# Altium schematic sheet Sheet1.SchDoc
size A2; SheetNumber: 1; SheetTotal: 1
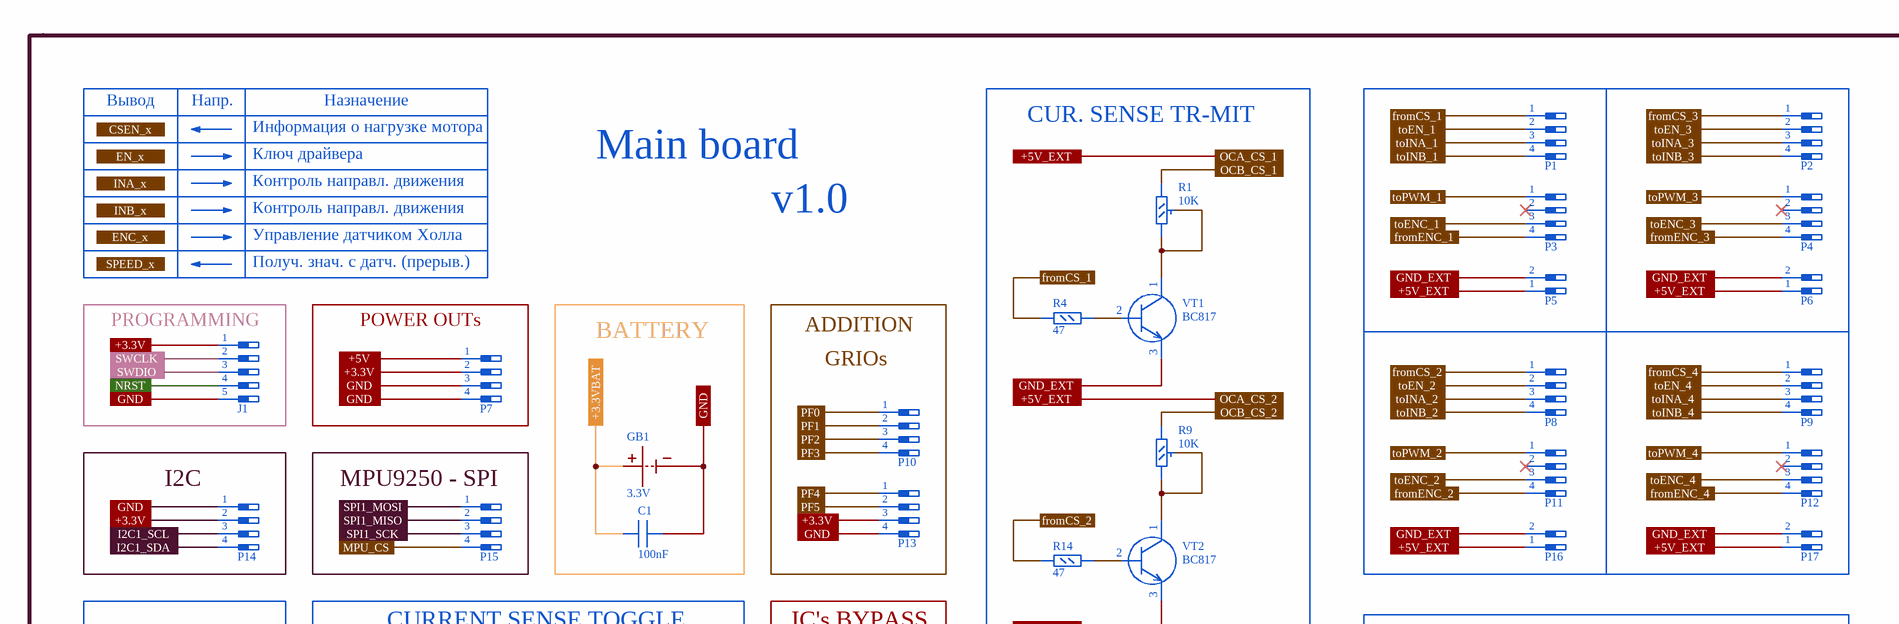
[diagram p0: Sheet1.SchDoc, top left]
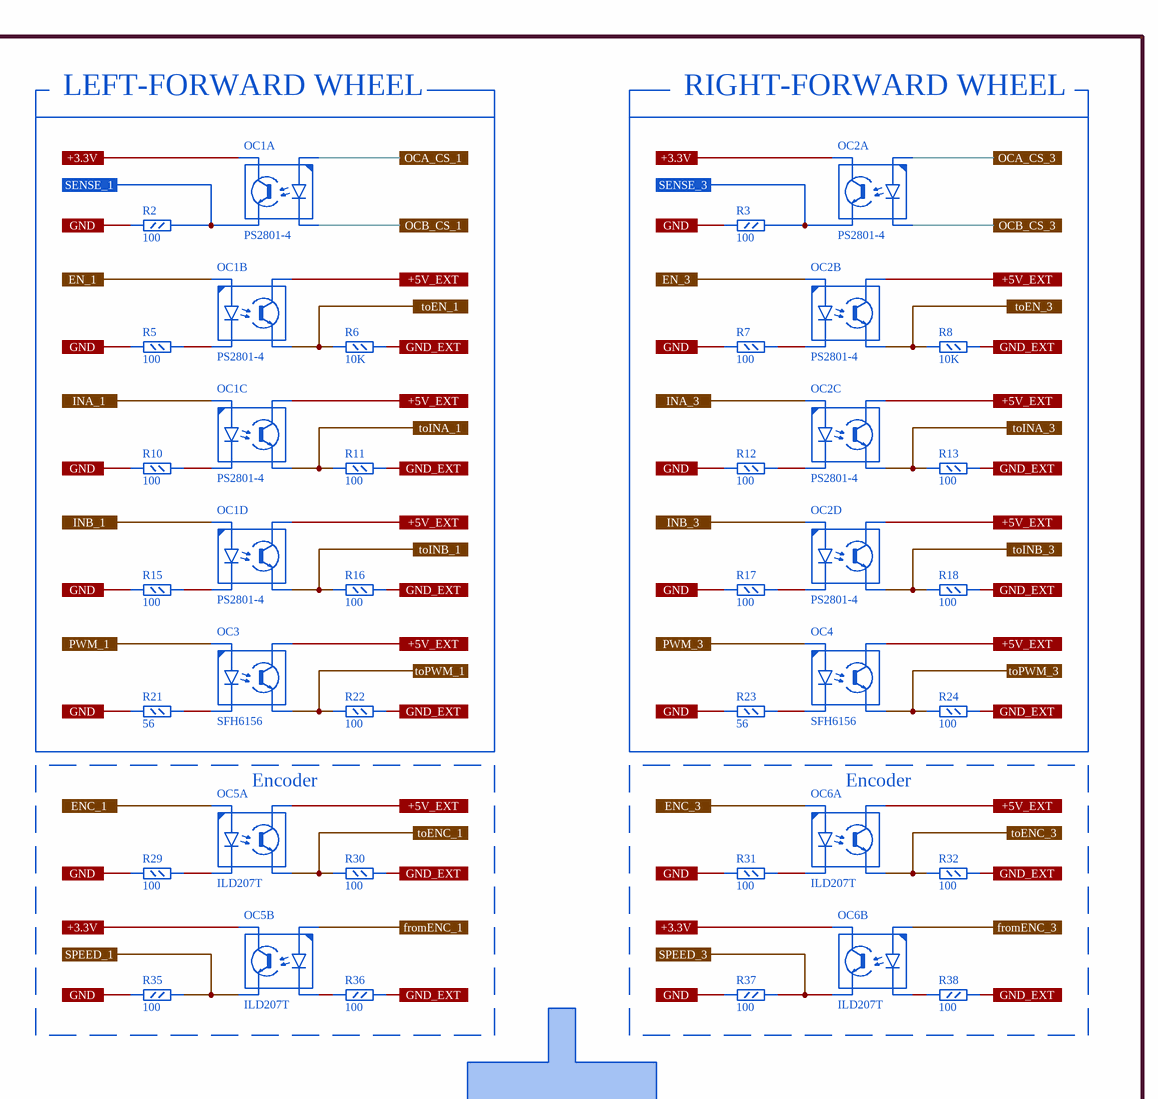
[diagram p1: Sheet1.SchDoc, top right]
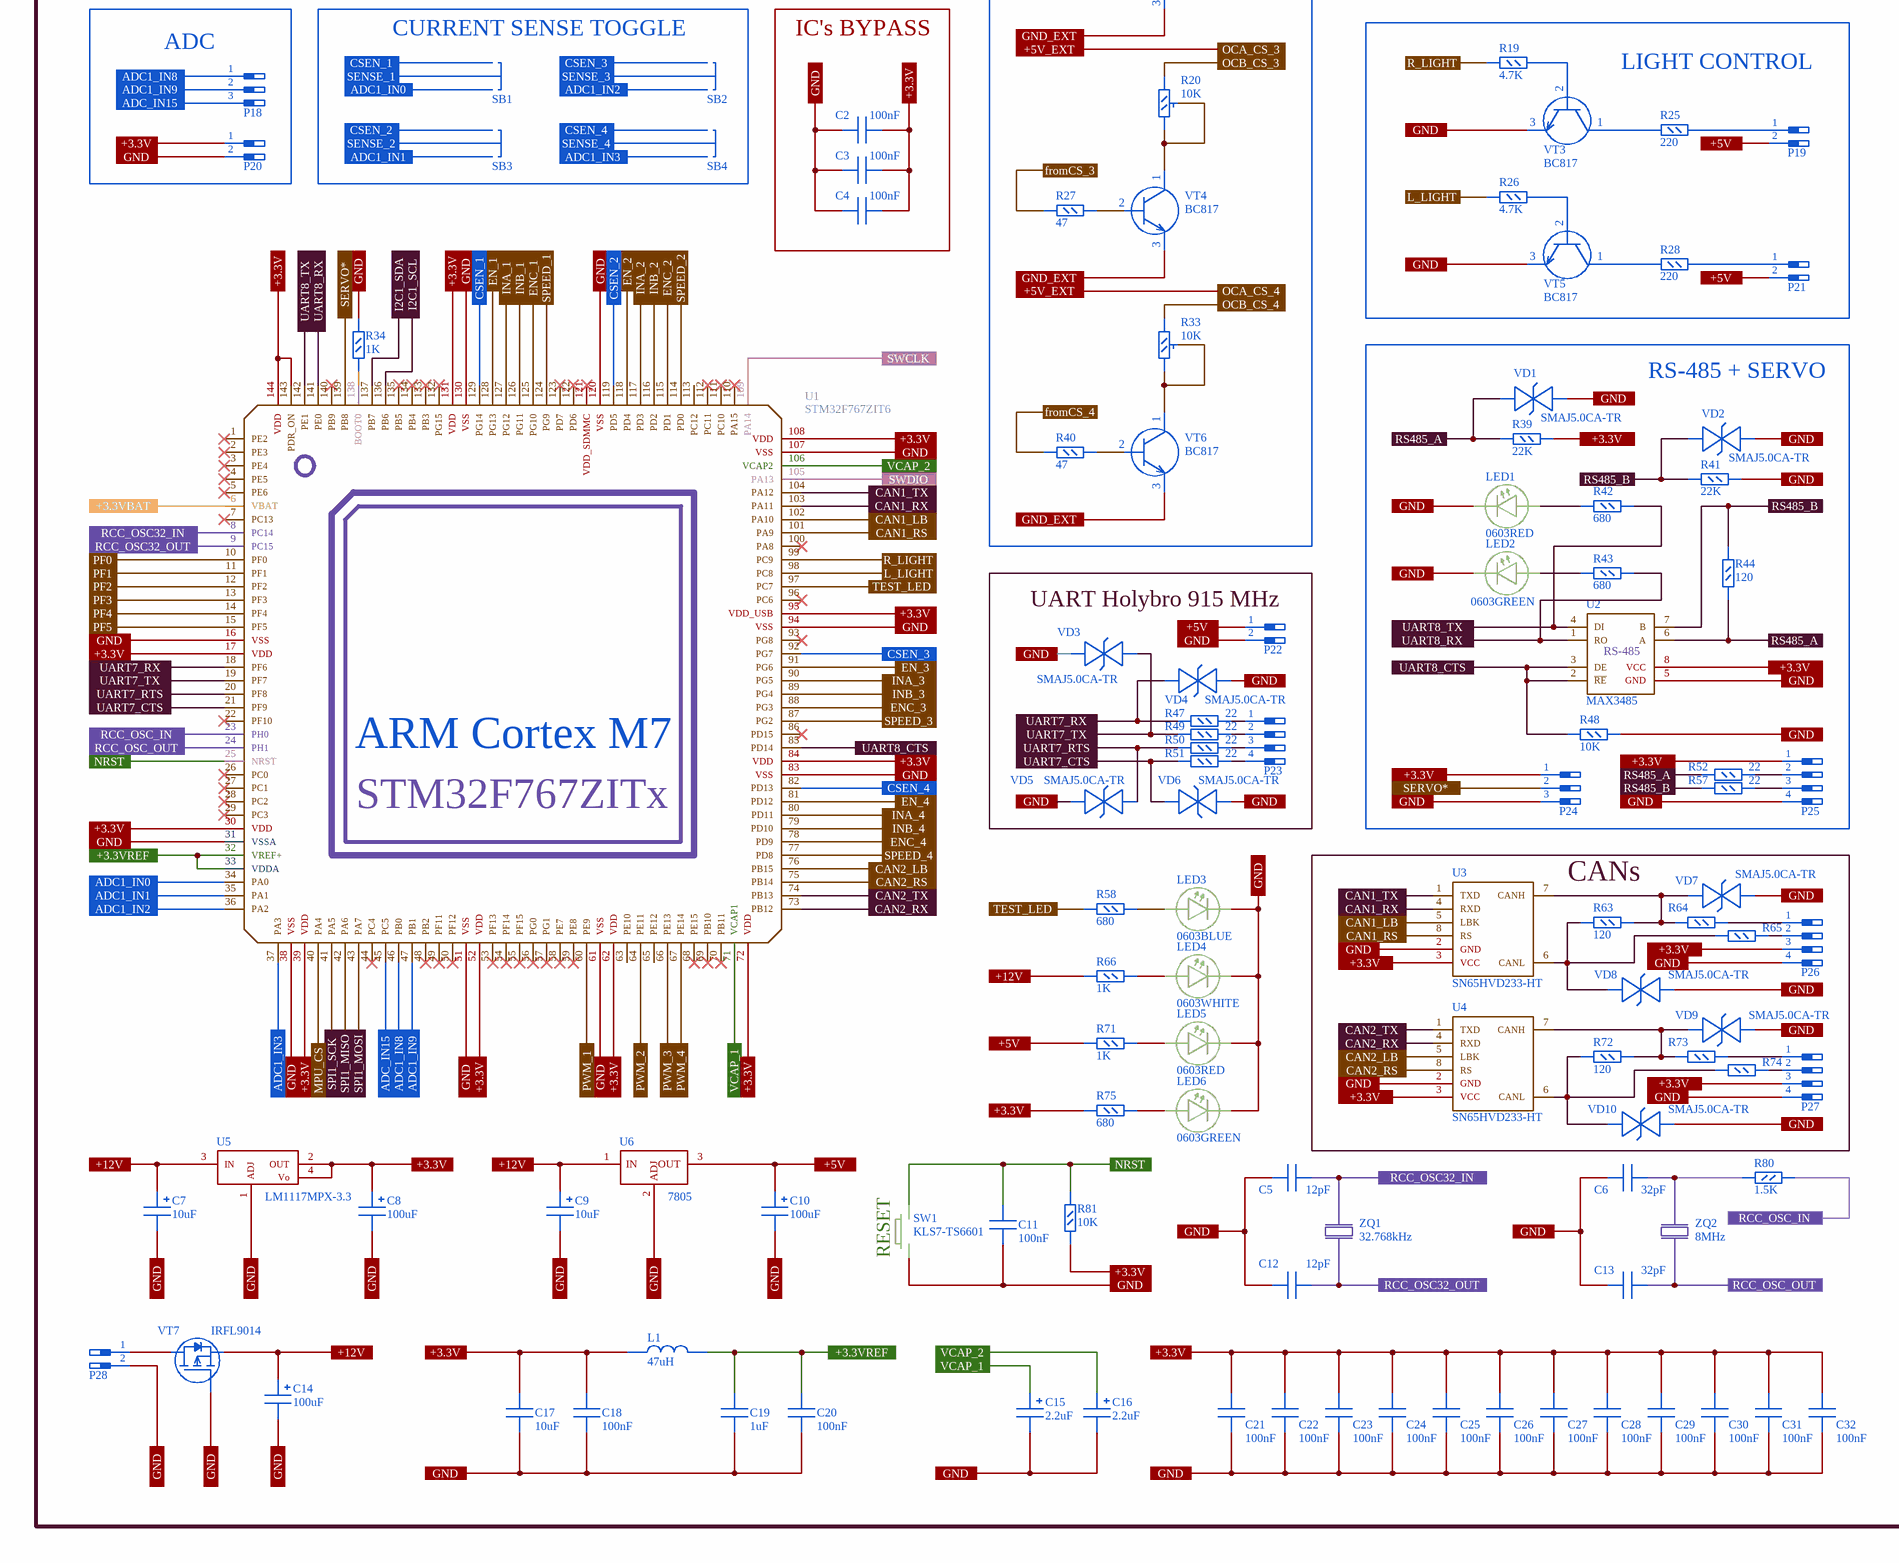
[diagram p2: Sheet1.SchDoc, bottom left]
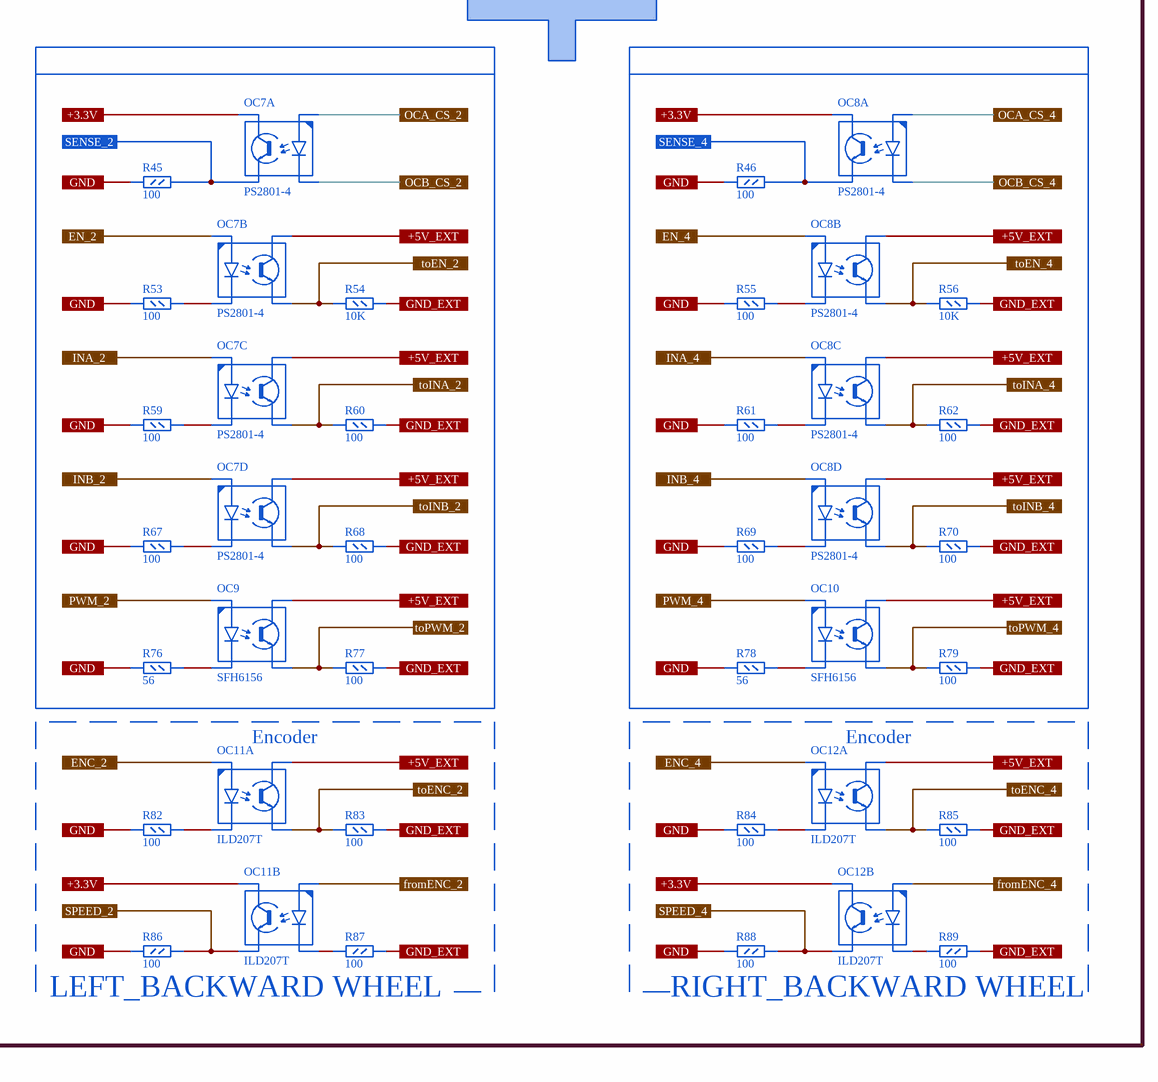
[diagram p3: Sheet1.SchDoc, bottom right]

## Parts
C1  100nF  [C0603]
C2  100nF  [C0603]
C3  100nF  [C0603]
C4  100nF  [C0603]
C5  12pF  [C0603]
C6  32pF  [C0603]
C7  10uF  [CAP-ALSMD-4x5.4]
C8  100uF  [CAP-ALSMD-6.3x5.4]
C9  10uF  [CAP-ALSMD-4x5.4]
C10  100uF  [CAP-ALSMD-6.3x5.4]
C11  100nF  [C0603]
C12  12pF  [C0603]
C13  32pF  [C0603]
C14  100uF  [CAP-ALSMD-6.3x5.4]
C15  2.2uF  [CAP-ALSMD-4x5.4]
C16  2.2uF  [CAP-ALSMD-4x5.4]
C17  10uF  [C0805]
C18  100nF  [C0603]
C19  1uF  [C0805]
C20  100nF  [C0603]
C21  100nF  [C0603]
C22  100nF  [C0603]
C23  100nF  [C0603]
C24  100nF  [C0603]
C25  100nF  [C0603]
C26  100nF  [C0603]
C27  100nF  [C0603]
C28  100nF  [C0603]
C29  100nF  [C0603]
C30  100nF  [C0603]
C31  100nF  [C0603]
C32  100nF  [C0603]
GB1  3.3V  [CR1616-SMD]
J1  1x05  [5X1F]  (value not drawn)
L1  47uH  [L0805]
LED1  0603RED  [LED0603]
LED2  0603GREEN  [LED0603]
LED3  0603BLUE  [LED0603]
LED4  0603WHITE  [LED0603]
LED5  0603RED  [LED0603]
LED6  0603GREEN  [LED0603]
OC1  PS2801-4  [SOP16]  (parts A,B,C,D of 4)
OC2  PS2801-4  [SOP16]  (parts A,B,C,D of 4)
OC3  SFH6156  [SMD-4 (WIDE PINS)]
OC4  SFH6156  [SMD-4 (WIDE PINS)]
OC5  ILD207T  [SOIC8]  (parts A,B of 2)
OC6  ILD207T  [SOIC8]  (parts A,B of 2)
OC7  PS2801-4  [SOP16]  (parts A,B,C,D of 4)
OC8  PS2801-4  [SOP16]  (parts A,B,C,D of 4)
OC9  SFH6156  [SMD-4 (WIDE PINS)]
OC10  SFH6156  [SMD-4 (WIDE PINS)]
OC11  ILD207T  [SOIC8]  (parts A,B of 2)
OC12  ILD207T  [SOIC8]  (parts A,B of 2)
P1  1x04  [CWF-4R-2.50]  (value not drawn)
P2  1x04  [CWF-4R-2.50]  (value not drawn)
P3  1x04  [CWF-4R-2.50]  (value not drawn)
P4  1x04  [CWF-4R-2.50]  (value not drawn)
P5  1x02  [H2-5.08]  (value not drawn)
P6  1x02  [H2-5.08]  (value not drawn)
P7  1x04  [XH2.54-4PIN]  (value not drawn)
P8  1x04  [CWF-4R-2.50]  (value not drawn)
P9  1x04  [CWF-4R-2.50]  (value not drawn)
P10  1x04  [XH2.54-4PIN]  (value not drawn)
P11  1x04  [CWF-4R-2.50]  (value not drawn)
P12  1x04  [CWF-4R-2.50]  (value not drawn)
P13  1x04  [XH2.54-4PIN]  (value not drawn)
P14  1x04  [XH2.54-4PIN]  (value not drawn)
P15  1x04  [XH2.54-4PIN]  (value not drawn)
P16  1x02  [H2-5.08]  (value not drawn)
P17  1x02  [H2-5.08]  (value not drawn)
P18  1x03  [XH2.54-3PIN]  (value not drawn)
P19  1x02  [XH2.54-2PIN]  (value not drawn)
P20  1x02  [XH2.54-2PIN]  (value not drawn)
P21  1x02  [XH2.54-2PIN]  (value not drawn)
P22  1x02  [XH2.54-2PIN]  (value not drawn)
P23  1x04  [XH2.54-4PIN]  (value not drawn)
P24  1x03  [XH2.54-3PIN]  (value not drawn)
P25  1x04  [XH2.54-4PIN]  (value not drawn)
P26  1x04  [XH2.54-4PIN]  (value not drawn)
P27  1x04  [XH2.54-4PIN]  (value not drawn)
P28  1x02  [H2-5.08]  (value not drawn)
R1  10K  [EVM3]
R2  100  [R0603]
R3  100  [R0603]
R4  47  [R0805]
R5  100  [R0603]
R6  10K  [R0603]
R7  100  [R0603]
R8  10K  [R0603]
R9  10K  [EVM3]
R10  100  [R0603]
R11  100  [R0603]
R12  100  [R0603]
R13  100  [R0603]
R14  47  [R0805]
R15  100  [R0603]
R16  100  [R0603]
R17  100  [R0603]
R18  100  [R0603]
R19  4.7K  [R0603]
R20  10K  [EVM3]
R21  56  [R0805]
R22  100  [R0603]
R23  56  [R0805]
R24  100  [R0603]
R25  220  [R0603]
R26  4.7K  [R0603]
R27  47  [R0805]
R28  220  [R0603]
R29  100  [R0603]
R30  100  [R0603]
R31  100  [R0603]
R32  100  [R0603]
R33  10K  [EVM3]
R34  1K  [R0603]
R35  100  [R0603]
R36  100  [R0603]
R37  100  [R0603]
R38  100  [R0603]
R39  22K  [R0603]
R40  47  [R0805]
R41  22K  [R0603]
R42  680  [R0603]
R43  680  [R0603]
R44  120  [R0603]
R45  100  [R0603]
R46  100  [R0603]
R47  22  [R0805]
R48  10K  [R0603]
R49  22  [R0805]
R50  22  [R0805]
R51  22  [R0805]
R52  22  [R0805]
R53  100  [R0603]
R54  10K  [R0603]
R55  100  [R0603]
R56  10K  [R0603]
R57  22  [R0805]
R58  680  [R0603]
R59  100  [R0603]
R60  100  [R0603]
R61  100  [R0603]
R62  100  [R0603]
R63  120  [R0603]
R64  22  [R0805]  (value not drawn)
R65  22  [R0805]  (value not drawn)
R66  1K  [R0603]
R67  100  [R0603]
R68  100  [R0603]
R69  100  [R0603]
R70  100  [R0603]
R71  1K  [R0603]
R72  120  [R0603]
R73  22  [R0805]  (value not drawn)
R74  22  [R0805]  (value not drawn)
R75  680  [R0603]
R76  56  [R0805]
R77  100  [R0603]
R78  56  [R0805]
R79  100  [R0603]
R80  1.5K  [R0603]
R81  10K  [R0603]
R82  100  [R0603]
R83  100  [R0603]
R84  100  [R0603]
R85  100  [R0603]
R86  100  [R0603]
R87  100  [R0603]
R88  100  [R0603]
R89  100  [R0603]
SB1  Soldier Toggle  [SOLDBR-3]  (value not drawn)
SB2  Soldier Toggle  [SOLDBR-3]  (value not drawn)
SB3  Soldier Toggle  [SOLDBR-3]  (value not drawn)
SB4  Soldier Toggle  [SOLDBR-3]  (value not drawn)
SW1  KLS7-TS6601  [BUT6.5X4.5]
U1  STM32F767ZIT6  [LQFP144]
U2  MAX3485  [SOIC8]
U3  SN65HVD233-HT  [SOIC8]
U4  SN65HVD233-HT  [SOIC8]
U5  LM1117MPX-3.3  [SOT-223]
U6  7805  [D2PAK]
VD1  SMAJ5.0CA-TR  [SMA]
VD2  SMAJ5.0CA-TR  [SMA]
VD3  SMAJ5.0CA-TR  [SMA]
VD4  SMAJ5.0CA-TR  [SMA]
VD5  SMAJ5.0CA-TR  [SMA]
VD6  SMAJ5.0CA-TR  [SMA]
VD7  SMAJ5.0CA-TR  [SMA]
VD8  SMAJ5.0CA-TR  [SMA]
VD9  SMAJ5.0CA-TR  [SMA]
VD10  SMAJ5.0CA-TR  [SMA]
VT1  BC817  [SOT-23-1P]
VT2  BC817  [SOT-23-1P]
VT3  BC817  [SOT-23-1P]
VT4  BC817  [SOT-23-1P]
VT5  BC817  [SOT-23-1P]
VT6  BC817  [SOT-23-1P]
VT7  IRFL9014  [SOT-223-24]
ZQ1  32.768kHz  [NX3215SA]
ZQ2  8MHz  [CRYSTALL-SMD]

## Blocks framed on the sheet
CUR. SENSE TR-MIT: R1 R4 R9 R14 R20 R27 R33 R40 VT1 VT2 VT4 VT6
PROGRAMMING: J1
POWER OUTs: P7
BATTERY: C1 GB1
I2C: P14
MPU9250 - SPI: P15
ADC: P18 P20
CURRENT SENSE TOGGLE: SB1-SB4
IC's BYPASS: C2-C4
LIGHT CONTROL: P19 P21 R19 R25 R26 R28 VT3 VT5
RS-485 + SERVO: LED1 LED2 P24 P25 R39 R41-R44 R48 R52 R57 U2 VD1 VD2
UART Holybro 915 MHz: P22 P23 R47 R49-R51 VD3-VD6
CANs: P26 P27 R63-R65 R72-R74 U3 U4 VD7-VD10

## Ports
+3.3V, +3.3VBAT, +3.3VREF, +5V, +5V_EXT, +12V, ADC1_IN0, ADC1_IN1, ADC1_IN2, ADC1_IN3, ADC1_IN8, ADC1_IN9, ADC_IN15, CAN1_LB, CAN1_RS, CAN1_RX, CAN1_TX, CAN2_LB, CAN2_RS, CAN2_RX, CAN2_TX, CSEN_1, CSEN_2, CSEN_3, CSEN_4, CSEN_x, EN_1, EN_2, EN_3, EN_4, EN_x, ENC_1, ENC_2, ENC_3, ENC_4, ENC_x, fromCS_1, fromCS_2, fromCS_3, fromCS_4, fromENC_1, fromENC_2, fromENC_3, fromENC_4, GND, GND_EXT, I2C1_SCL, I2C1_SDA, INA_1, INA_2, INA_3, INA_4, INA_x, INB_1, INB_2, INB_3, INB_4, INB_x, L_LIGHT, MPU_CS, NRST, OCA_CS_1, OCA_CS_2, OCA_CS_3, OCA_CS_4, OCB_CS_1, OCB_CS_2, OCB_CS_3, OCB_CS_4, PF0, PF1, PF2, PF3, PF4, PF5, PWM_1, PWM_2, PWM_3, PWM_4, R_LIGHT, RCC_OSC32_IN, RCC_OSC32_OUT, RCC_OSC_IN, RCC_OSC_OUT, RS485_A, RS485_B, SENSE_1, SENSE_2, SENSE_3, SENSE_4, SERVO*, SPEED_1, SPEED_2, SPEED_3, SPEED_4, SPEED_x, SPI1_MISO, SPI1_MOSI, SPI1_SCK, SWCLK, SWDIO, TEST_LED, toEN_1, toEN_2, toEN_3, toEN_4, toENC_1, toENC_2, toENC_3, toENC_4, toINA_1, toINA_2, toINA_3, toINA_4, toINB_1, toINB_2, toINB_3, toINB_4, toPWM_1, toPWM_2, toPWM_3, toPWM_4, UART7_CTS, UART7_RTS, UART7_RX, UART7_TX, UART8_CTS, UART8_RX, UART8_TX, VCAP_1, VCAP_2

## Nets
+3.3V: C2.2 C3.2 C4.2 C8.1 C17.2 C18.2 C21.2 C22.2 C23.2 C24.2 C25.2 C26.2 C27.2 C28.2 C29.2 C30.2 C31.2 C32.2 J1.1 L1.1 OC1.16 OC2.16 OC5.6 OC6.6 OC7.16 OC8.16 OC11.6 OC12.6 P7.2 P13.3 P14.2 P20.1 P24.1 P25.1 P26.3 P27.3 R39.1 R75.2 R81.2 U1.17(VDD) U1.30(VDD) U1.39(VDD) U1.52(VDD) U1.62(VDD) U1.72(VDD) U1.84(VDD) U1.95(VDD_USB) U1.108(VDD) U1.131(VDD) U1.143(PDR_ON) U1.144(VDD) U2.8(VCC) U3.3(VCC) U4.3(VCC) U5.2(OUT) U5.4(Vo) ; port +3.3V
+3.3VBAT: C1.1 GB1.2 U1.6(VBAT) ; port +3.3VBAT
+3.3VREF: C19.2 C20.2 L1.2 U1.32(VREF+) U1.33(VDDA) ; port +3.3VREF
+5V: C10.1 P7.1 P19.2 P21.2 P22.1 R71.2 U6.3(OUT) ; port +5V
+5V_EXT: OC1.1 OC1.10 OC1.12 OC1.14 OC2.1 OC2.10 OC2.12 OC2.14 OC3.4 OC4.4 OC5.8 OC6.8 OC7.1 OC7.10 OC7.12 OC7.14 OC8.1 OC8.10 OC8.12 OC8.14 OC9.4 OC10.4 OC11.8 OC12.8 P5.1 P6.1 P16.1 P17.1 ; port +5V_EXT, port OCA_CS_1, port OCA_CS_2, port OCA_CS_3, port OCA_CS_4
+12V: C7.1 C9.1 C14.1 R66.2 U5.3(IN) U6.1(IN) VT7.3(S) ; port +12V
ADC1_IN0: SB1.3 U1.34(PA0) ; port ADC1_IN0
ADC1_IN1: SB3.3 U1.35(PA1) ; port ADC1_IN1
ADC1_IN2: SB2.3 U1.36(PA2) ; port ADC1_IN2
ADC1_IN3: SB4.3 U1.37(PA3) ; port ADC1_IN3
ADC1_IN8: P18.1 U1.46(PB0) ; port ADC1_IN8
ADC1_IN9: P18.2 U1.47(PB1) ; port ADC1_IN9
ADC_IN15: P18.3 U1.45(PC5) ; port ADC_IN15
CAN1_LB: U1.102(PA10) U3.5(LBK) ; port CAN1_LB
CAN1_RS: U1.101(PA9) U3.8(RS) ; port CAN1_RS
CAN1_RX: U1.103(PA11) U3.4(RXD) ; port CAN1_RX
CAN1_TX: U1.104(PA12) U3.1(TXD) ; port CAN1_TX
CAN2_LB: U1.76(PB15) U4.5(LBK) ; port CAN2_LB
CAN2_RS: U1.75(PB14) U4.8(RS) ; port CAN2_RS
CAN2_RX: U1.73(PB12) U4.4(RXD) ; port CAN2_RX
CAN2_TX: U1.74(PB13) U4.1(TXD) ; port CAN2_TX
CSEN_1: SB1.1 U1.129(PG14) ; port CSEN_1
CSEN_2: SB3.1 U1.119(PD5) ; port CSEN_2
CSEN_3: SB2.1 U1.92(PG7) ; port CSEN_3
CSEN_4: SB4.1 U1.82(PD13) ; port CSEN_4
EN_1: OC1.3 U1.128(PG13) ; port EN_1
EN_2: OC7.3 U1.118(PD4) ; port EN_2
EN_3: OC2.3 U1.91(PG6) ; port EN_3
EN_4: OC8.3 U1.81(PD12) ; port EN_4
ENC_1: OC5.1 U1.125(PG10) ; port ENC_1
ENC_2: OC11.1 U1.115(PD1) ; port ENC_2
ENC_3: OC6.1 U1.88(PG3) ; port ENC_3
ENC_4: OC12.1 U1.78(PD9) ; port ENC_4
fromCS_1: P1.1 R4.1 ; port fromCS_1
fromCS_2: P8.1 R14.1 ; port fromCS_2
fromCS_3: P2.1 R27.1 ; port fromCS_3
fromCS_4: P9.1 R40.1 ; port fromCS_4
fromENC_1: OC5.3 P3.4 ; port fromENC_1
fromENC_2: OC11.3 P11.4 ; port fromENC_2
fromENC_3: OC6.3 P4.4 ; port fromENC_3
fromENC_4: OC12.3 P12.4 ; port fromENC_4
GND: C1.2 C2.1 C3.1 C4.1 C5.2 C6.2 C7.2 C8.2 C9.2 C10.2 C11.1 C12.2 C13.2 C14.2 C15.2 C16.2 C17.1 C18.1 C19.1 C20.1 C21.1 C22.1 C23.1 C24.1 C25.1 C26.1 C27.1 C28.1 C29.1 C30.1 C31.1 C32.1 GB1.1(+) J1.5 LED1.2 LED2.2 LED3.2 LED4.2 LED5.2 LED6.2 P7.3 P7.4 P13.4 P14.1 P20.2 P22.2 P24.3 P25.4 P26.4 P27.4 P28.2 R2.2 R3.2 R5.1 R7.1 R10.1 R12.1 R15.1 R17.1 R21.1 R23.1 R29.1 R31.1 R34.2 R35.2 R37.2 R41.1 R45.2 R46.2 R48.1 R53.1 R55.1 R59.1 R61.1 R67.1 R69.1 R76.1 R78.1 R82.1 R84.1 R86.2 R88.2 SW1.1(Q1) U1.16(VSS) U1.31(VSSA) U1.38(VSS) U1.51(VSS) U1.61(VSS) U1.83(VSS) U1.94(VSS) U1.107(VSS) U1.120(VSS) U1.130(VSS) U2.5(GND) U3.2(GND) U4.2(GND) U5.1(ADJ) U6.2(ADJ) VD1.2 VD2.2 VD3.2 VD4.2 VD5.2 VD6.2 VD7.2 VD8.2 VD9.2 VD10.2 VT3.3 VT5.3 VT7.1(G) ; port GND
GND_EXT: P5.2 P6.2 P16.2 P17.2 R6.2 R8.2 R11.2 R13.2 R16.2 R18.2 R22.2 R24.2 R30.2 R32.2 R36.1 R38.1 R54.2 R56.2 R60.2 R62.2 R68.2 R70.2 R77.2 R79.2 R83.2 R85.2 R87.1 R89.1 VT1.3 VT2.3 VT4.3 VT6.3 ; port GND_EXT
I2C1_SCL: P14.3 U1.136(PB6) ; port I2C1_SCL
I2C1_SDA: P14.4 U1.137(PB7) ; port I2C1_SDA
INA_1: OC1.5 U1.127(PG12) ; port INA_1
INA_2: OC7.5 U1.117(PD3) ; port INA_2
INA_3: OC2.5 U1.90(PG5) ; port INA_3
INA_4: OC8.5 U1.80(PD11) ; port INA_4
INB_1: OC1.7 U1.126(PG11) ; port INB_1
INB_2: OC7.7 U1.116(PD2) ; port INB_2
INB_3: OC2.7 U1.89(PG4) ; port INB_3
INB_4: OC8.7 U1.79(PD10) ; port INB_4
L_LIGHT: R26.1 U1.98(PC8) ; port L_LIGHT
MPU_CS: P15.4 U1.40(PA4) ; port MPU_CS
NRST: C11.2 J1.4 R81.1 SW1.3(Q2) U1.25(NRST) ; port NRST
OCB_CS_1: OC1.2 R1.1 ; port OCB_CS_1
OCB_CS_2: OC7.2 R9.1 ; port OCB_CS_2
OCB_CS_3: OC2.2 R20.1 ; port OCB_CS_3
OCB_CS_4: OC8.2 R33.1 ; port OCB_CS_4
PF0: P10.1 U1.10(PF0) ; port PF0
PF1: P10.2 U1.11(PF1) ; port PF1
PF2: P10.3 U1.12(PF2) ; port PF2
PF3: P10.4 U1.13(PF3) ; port PF3
PF4: P13.1 U1.14(PF4) ; port PF4
PF5: P13.2 U1.15(PF5) ; port PF5
PWM_1: OC3.1 U1.60(PE9) ; port PWM_1
PWM_2: OC9.1 U1.64(PE11) ; port PWM_2
PWM_3: OC4.1 U1.66(PE13) ; port PWM_3
PWM_4: OC10.1 U1.67(PE14) ; port PWM_4
R_LIGHT: R19.1 U1.99(PC9) ; port R_LIGHT
RCC_OSC32_IN: C5.1 U1.8(PC14) ZQ1.1 ; port RCC_OSC32_IN
RCC_OSC32_OUT: C12.1 U1.9(PC15) ZQ1.2 ; port RCC_OSC32_OUT
RCC_OSC_IN: R80.1 U1.23(PH0) ; port RCC_OSC_IN
RCC_OSC_OUT: C13.1 U1.24(PH1) ZQ2.2 ; port RCC_OSC_OUT
RS485_A: R39.2 R44.1 R52.2 U2.6(A) VD1.1 ; port RS485_A
RS485_B: R41.2 R44.2 R57.2 U2.7(B) VD2.1 ; port RS485_B
SENSE_1: OC1.15 R2.1 SB1.2 ; port SENSE_1
SENSE_2: OC7.15 R45.1 SB3.2 ; port SENSE_2
SENSE_3: OC2.15 R3.1 SB2.2 ; port SENSE_3
SENSE_4: OC8.15 R46.1 SB4.2 ; port SENSE_4
SERVO*: P24.2 U1.139(PB8) ; port SERVO*
SPEED_1: OC5.5 R35.1 U1.124(PG9) ; port SPEED_1
SPEED_2: OC11.5 R86.1 U1.114(PD0) ; port SPEED_2
SPEED_3: OC6.5 R37.1 U1.87(PG2) ; port SPEED_3
SPEED_4: OC12.5 R88.1 U1.77(PD8) ; port SPEED_4
SPI1_MISO: P15.2 U1.42(PA6) ; port SPI1_MISO
SPI1_MOSI: P15.1 U1.43(PA7) ; port SPI1_MOSI
SPI1_SCK: P15.3 U1.41(PA5) ; port SPI1_SCK
SWCLK: J1.2 U1.109(PA14) ; port SWCLK
SWDIO: J1.3 U1.105(PA13) ; port SWDIO
TEST_LED: R58.2 U1.97(PC7) ; port TEST_LED
toEN_1: OC1.13 P1.2 R6.1 ; port toEN_1
toEN_2: OC7.13 P8.2 R54.1 ; port toEN_2
toEN_3: OC2.13 P2.2 R8.1 ; port toEN_3
toEN_4: OC8.13 P9.2 R56.1 ; port toEN_4
toENC_1: OC5.7 P3.3 R30.1 ; port toENC_1
toENC_2: OC11.7 P11.3 R83.1 ; port toENC_2
toENC_3: OC6.7 P4.3 R32.1 ; port toENC_3
toENC_4: OC12.7 P12.3 R85.1 ; port toENC_4
toINA_1: OC1.11 P1.3 R11.1 ; port toINA_1
toINA_2: OC7.11 P8.3 R60.1 ; port toINA_2
toINA_3: OC2.11 P2.3 R13.1 ; port toINA_3
toINA_4: OC8.11 P9.3 R62.1 ; port toINA_4
toINB_1: OC1.9 P1.4 R16.1 ; port toINB_1
toINB_2: OC7.9 P8.4 R68.1 ; port toINB_2
toINB_3: OC2.9 P2.4 R18.1 ; port toINB_3
toINB_4: OC8.9 P9.4 R70.1 ; port toINB_4
toPWM_1: OC3.3 P3.1 R22.1 ; port toPWM_1
toPWM_2: OC9.3 P11.1 R77.1 ; port toPWM_2
toPWM_3: OC4.3 P4.1 R24.1 ; port toPWM_3
toPWM_4: OC10.3 P12.1 R79.1 ; port toPWM_4
UART7_CTS: R51.2 U1.21(PF9) VD6.1 ; port UART7_CTS
UART7_RTS: R50.2 U1.20(PF8) VD5.1 ; port UART7_RTS
UART7_RX: R47.2 U1.18(PF6) VD4.1 ; port UART7_RX
UART7_TX: R49.2 U1.19(PF7) VD3.1 ; port UART7_TX
UART8_CTS: R48.2 U1.85(PD14) U2.2(~{RE}) U2.3(DE) ; port UART8_CTS
UART8_RX: R43.1 U1.141(PE0) U2.1(RO) ; port UART8_RX
UART8_TX: R42.1 U1.142(PE1) U2.4(DI) ; port UART8_TX
VCAP_1: C15.1 U1.71(VCAP1) ; port VCAP_1
VCAP_2: C16.1 U1.106(VCAP2) ; port VCAP_2
NetC6_1: C6.1 R80.2 ZQ2.1
NetLED1_1: LED1.1 R42.2
NetLED2_1: LED2.1 R43.2
NetLED3_1: LED3.1 R58.1
NetLED4_1: LED4.1 R66.1
NetLED5_1: LED5.1 R71.1
NetLED6_1: LED6.1 R75.1
NetOC1_4: OC1.4 R5.2
NetOC1_6: OC1.6 R10.2
NetOC1_8: OC1.8 R15.2
NetOC2_4: OC2.4 R7.2
NetOC2_6: OC2.6 R12.2
NetOC2_8: OC2.8 R17.2
NetOC3_2: OC3.2 R21.2
NetOC4_2: OC4.2 R23.2
NetOC5_2: OC5.2 R29.2
NetOC5_4: OC5.4 R36.2
NetOC6_2: OC6.2 R31.2
NetOC6_4: OC6.4 R38.2
NetOC7_4: OC7.4 R53.2
NetOC7_6: OC7.6 R59.2
NetOC7_8: OC7.8 R67.2
NetOC8_4: OC8.4 R55.2
NetOC8_6: OC8.6 R61.2
NetOC8_8: OC8.8 R69.2
NetOC9_2: OC9.2 R76.2
NetOC10_2: OC10.2 R78.2
NetOC11_2: OC11.2 R82.2
NetOC11_4: OC11.4 R87.2
NetOC12_2: OC12.2 R84.2
NetOC12_4: OC12.4 R89.2
NetP19_1: P19.1 R25.2
NetP21_1: P21.1 R28.2
NetP23_1: P23.1 R47.1
NetP23_2: P23.2 R49.1
NetP23_3: P23.3 R50.1
NetP23_4: P23.4 R51.1
NetP25_2: P25.2 R52.1
NetP25_3: P25.3 R57.1
NetP26_1: P26.1 R64.1
NetP26_2: P26.2 R65.1
NetP27_1: P27.1 R73.1
NetP27_2: P27.2 R74.1
NetP28_1: P28.1 VT7.2(D)
NetR1_2: R1.2 R1.3 VT1.1
NetR4_2: R4.2 VT1.2
NetR9_2: R9.2 R9.3 VT2.1
NetR14_2: R14.2 VT2.2
NetR19_2: R19.2 VT3.2
NetR20_2: R20.2 R20.3 VT4.1
NetR25_1: R25.1 VT3.1
NetR26_2: R26.2 VT5.2
NetR27_2: R27.2 VT4.2
NetR28_1: R28.1 VT5.1
NetR33_2: R33.2 R33.3 VT6.1
NetR34_1: R34.1 U1.138(BOOT0)
NetR40_2: R40.2 VT6.2
NetR63_1: R63.1 R64.2 U3.7(CANH) VD7.1
NetR63_2: R63.2 R65.2 U3.6(CANL) VD8.1
NetR72_1: R72.1 R73.2 U4.7(CANH) VD9.1
NetR72_2: R72.2 R74.2 U4.6(CANL) VD10.1

Not connected (* = marked no-connect by the designer): P3 2*; P4 2*; P11 2*; P12 2*; SW1 2(Q1) 4(Q2); U1 1(PE2)* 2(PE3)* 3(PE4)* 4(PE5)* 5(PE6)* 7(PC13)* 22(PF10)* 26(PC0)* 27(PC1)* 28(PC2)* 29(PC3)* 44(PC4)* 48(PB2)* 49(PF11)* 50(PF12)* 53(PF13)* 54(PF14)* 55(PF15)* 56(PG0)* 57(PG1)* 58(PE7)* 59(PE8)* 63(PE10) 65(PE12) 68(PE15)* 69(PB10)* 70(PB11)* 86(PD15)* 93(PG8)* 96(PC6)* 100(PA8)* 110(PA15)* 111(PC10)* 112(PC11)* 113(PC12) 121(VDD_SDMMC)* 122(PD6)* 123(PD7)* 132(PG15)* 133(PB3)* 134(PB4)* 135(PB5)* 140(PB9)*

## Notes on the sheet
- Вывод
- Напр.
- Информация о нагрузке мотора
- Назначение
- LEFT-FORWARD WHEEL
- RIGHT-FORWARD WHEEL
- Ключ драйвера
- Контроль направл. движения
- Main board
- Управление датчиком Холла
- Получ. знач. с датч. (прерыв.)
- v1.0
- ADDITION
- (near P10) GRIOs
- (near OC5) Encoder
- (near OC6) Encoder
- (near OC11) Encoder
- (near OC12) Encoder
- (near SW1) RESET
- LEFT_BACKWARD WHEEL
- RIGHT_BACKWARD WHEEL
- (in symbol MAX485) RS-485
- (in symbol STM32F767ZITx) ARM Cortex M7

## Library data of the parts
C1-C6 C11-C13 C17-C32 = Cap
  C1-C4 C11 C18 C20-C32: Value: 100nF
  C5 C12: Value: 12pF
  C6 C13: Value: 32pF
  C17: Value: 10uF
  C19: Value: 1uF
C7-C10 C14-C16 = Cap_Pol
  C7 C9: Value: 10uF
  C8 C10 C14: Value: 100uF
  C15 C16: Value: 2.2uF
GB1 = Battery: Value: 3.3V; Type: CR1616
L1 = Inductor: Value: 47uH
LED1-LED6 = LED
  LED1 LED5: Name: 0603RED
  LED2 LED6: Name: 0603GREEN
  LED3: Name: 0603BLUE
  LED4: Name: 0603WHITE
OC1 OC2 OC7 OC8 = Optocoupler-4: Name: PS2801-4
OC3 OC4 OC9 OC10 = Optocoupler: Name: SFH6156
OC5 OC6 OC11 OC12 = Optocoupler-2: Name: ILD207T
R1 R9 R20 R33 = Res Adj: Value: 10K
R2-R8 R10-R19 R21-R32 R34-R89 = Res
  R2 R3 R5 R7 R10-R13 R15-R18 R22 R24 R29-R32 R35-R38 R45 R46 R53 R55 R59-R62 R67-R70 R77 R79 R82-R89: Value: 100
  R4 R14 R27 R40: Value: 47
  R6 R8 R48 R54 R56 R81: Value: 10K
  R19 R26: Value: 4.7K
  R21 R23 R76 R78: Value: 56
  R25 R28: Value: 220
  R34 R66 R71: Value: 1K
  R39 R41: Value: 22K
  R42 R43 R58 R75: Value: 680
  R44 R63 R72: Value: 120
  R47 R49-R52 R57 R64 R65 R73 R74: Value: 22
  R80: Value: 1.5K
SB1-SB4 = Soldier Toggle: l: 10K
SW1 = Button_2: Name: KLS7-TS6601
U1 = STM32F767ZITx: Frequency: 216 MHz; Flash: 2048 kBytes; RAM: 512 kBytes; Name: STM32F767ZIT6
U2 = MAX485: Driver RS-485; Name: MAX3485
U3 U4 = SN65HVD233: 3.3-V CAN Transceiver; Name: SN65HVD233-HT
U5 = LM1117: Name: LM1117MPX-3.3
U6 = LM7805: Name: 7805
VD1-VD10 = Suppressor_bi-Dir: Value: 5V; Name: SMAJ5.0CA-TR
VT1-VT6 = NPN_CBE: Name: BC817
VT7 = MOSFET-P: Name: IRFL9014
ZQ1 ZQ2 = Crystall: Name: HC49SM
  ZQ1: Value: 32.768kHz
  ZQ2: Value: 8MHz